# Altium schematic sheet CPU_Memory.SchDoc
size A3
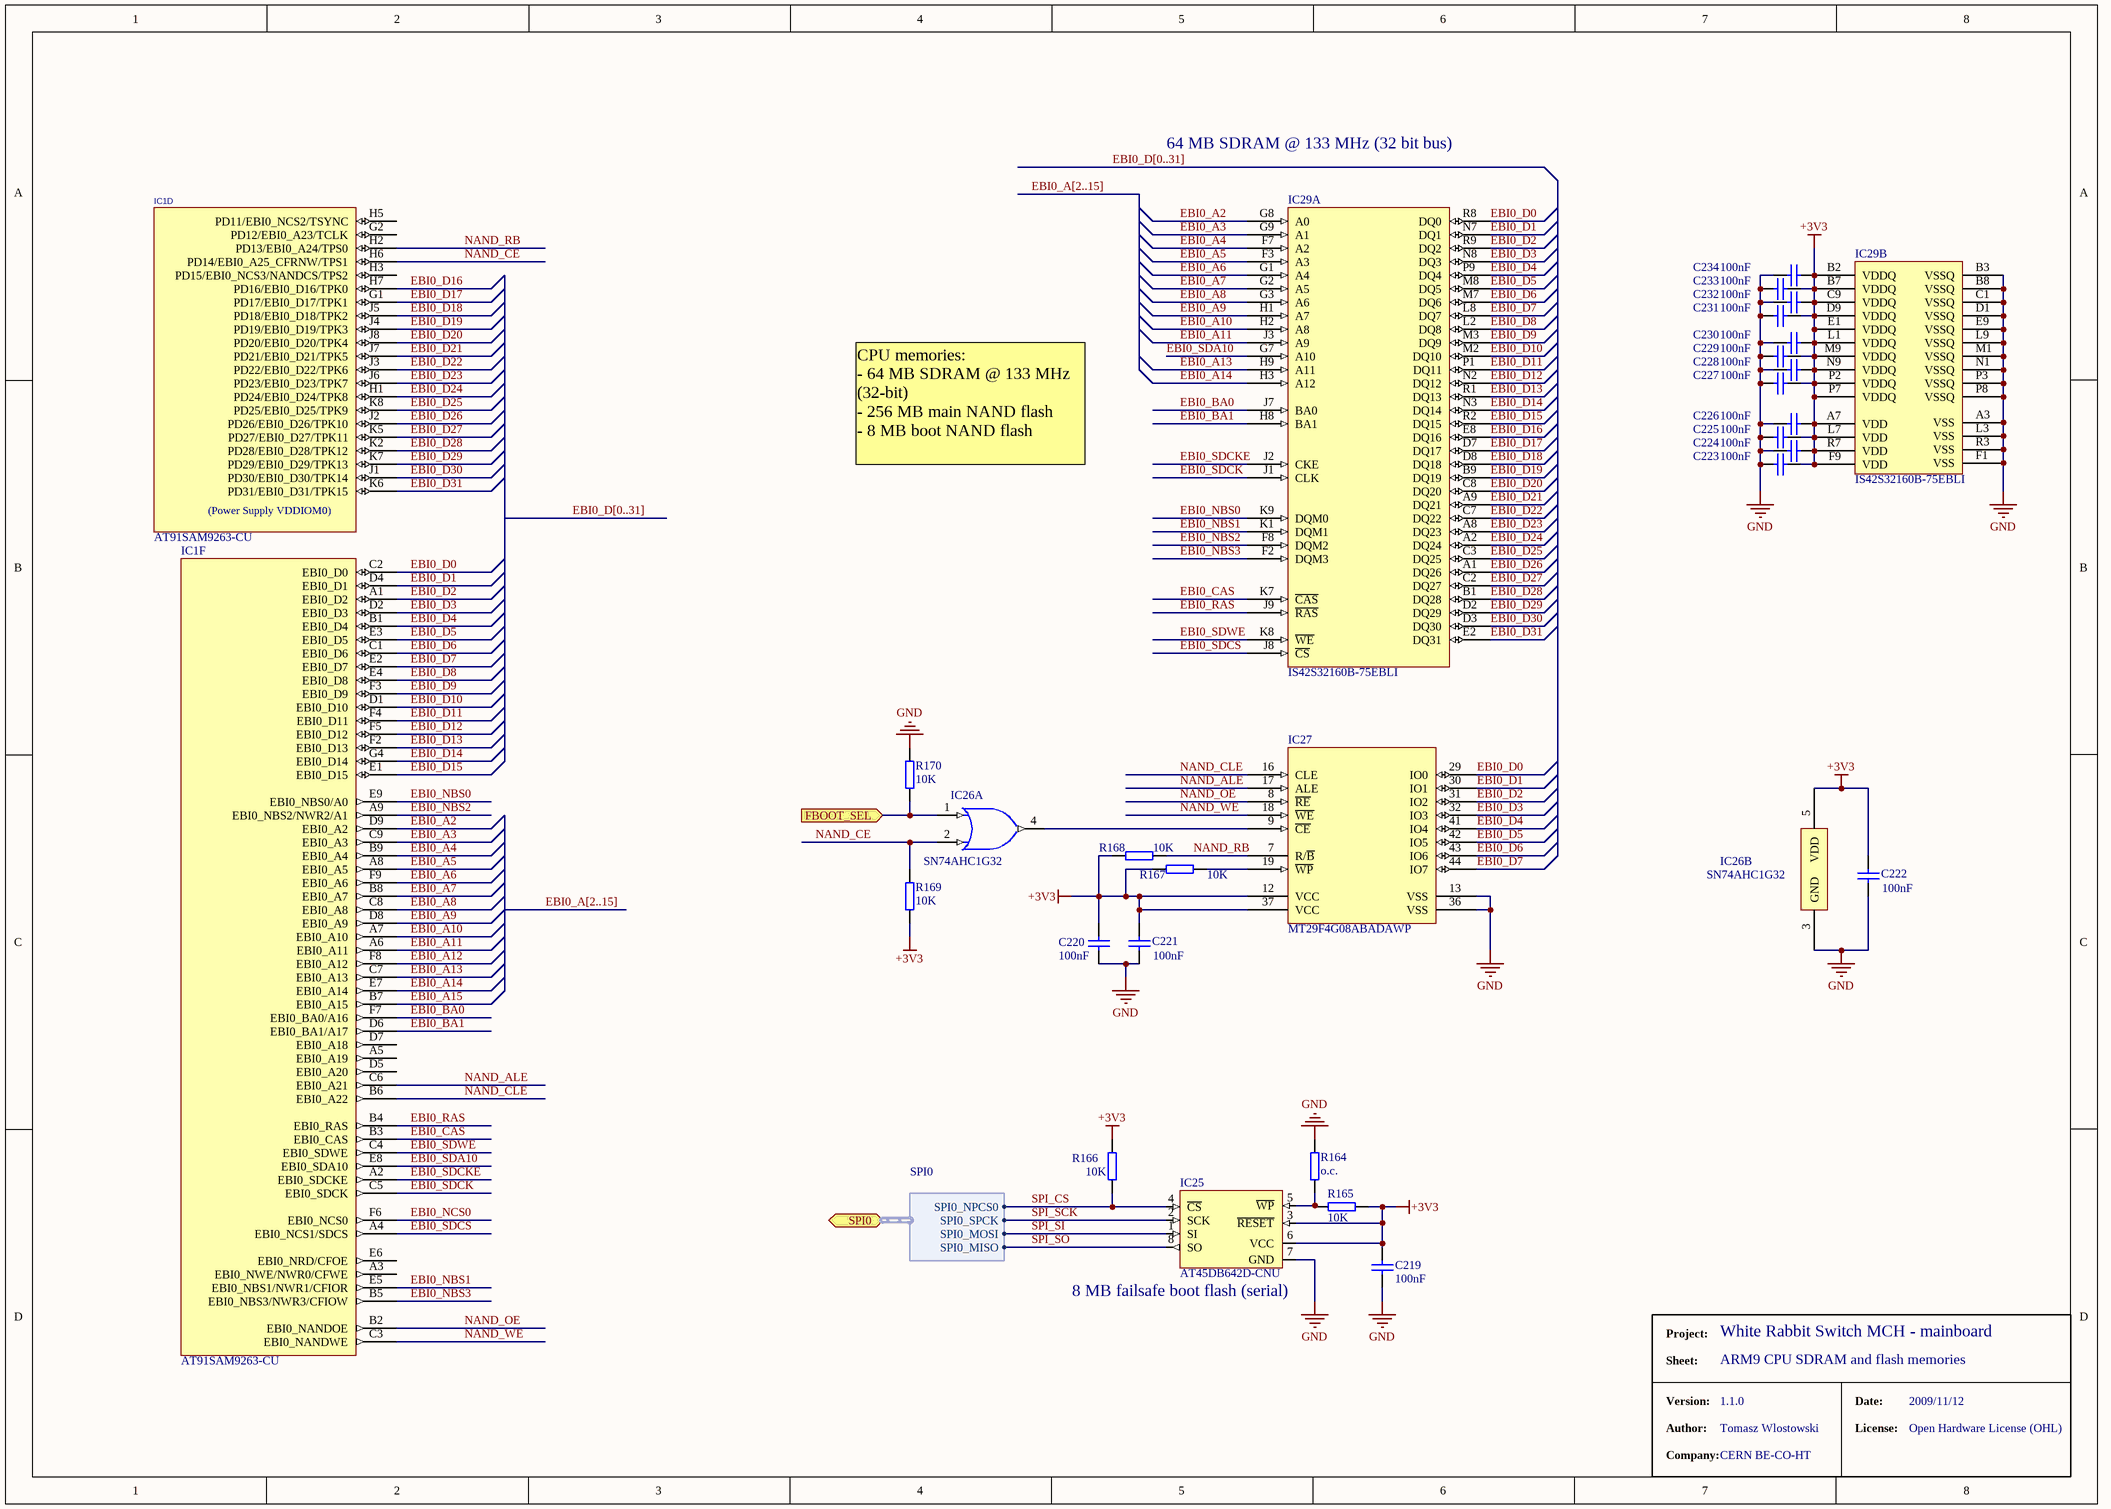
[diagram p0: CPU_Memory.SchDoc]

## Parts
(Parts that share a designator on the sheet are numbered #1, #2 ... from top to bottom, then left to right.)
C219  100nF  [CC1005-0402]
C220  100nF  [CC1005-0402]
C221  100nF  [CC1005-0402]
C222  100nF  [CC1005-0402]
C223  100nF  [CC1005-0402]
C224  100nF  [CC1005-0402]
C225  100nF  [CC1005-0402]
C226  100nF  [CC1005-0402]
C227  100nF  [CC1005-0402]
C228  100nF  [CC1005-0402]
C229  100nF  [CC1005-0402]
C230  100nF  [CC1005-0402]
C231  100nF  [CC1005-0402]
C232  100nF  [CC1005-0402]
C233  100nF  [CC1005-0402]
C234  100nF  [CC1005-0402]
IC1#1  AT91SAM9263-CU  [TFBGA324]  (part D of 12)
IC1#2  AT91SAM9263-CU  [TFBGA324]  (part F of 9)
IC25  AT45DB642D-CNU  [8CN3]
IC26  SN74AHC1G32  [SOT23-5AL]  (parts A,B of 2)
IC27  MT29F4G08ABADAWP  [TSOP48_12x20]
IC29  IS42S32160B-75EBLI  [BGA90C80P9X15_1300X1100X120]  (parts A,B of 2)
R164  o.c.  [0402]
R165  10K  [0402]
R166  10K  [0402]
R167  10K  [0402]
R168  10K  [0402]
R169  10K  [0402]
R170  10K  [0402]

## Ports
FBOOT_SEL (in), SPI0 (harness SPI0)

## Harnesses
SPI0: SPI0_MISO, SPI0_MOSI, SPI0_SPCK, SPI0_NPCS0

## Nets
+3V3: C219.1 C220.2 C221.2 C222.2 C223.1 C224.1 C225.1 C226.1 C227.1 C228.1 C229.1 C230.1 C231.1 C232.1 C233.1 C234.1 IC25.3(~{RESET}) IC25.6(VCC) IC26.5(VDD) IC27.12(VCC) IC27.37(VCC) IC29.A7(VDD) IC29.B2(VDDQ) IC29.B7(VDDQ) IC29.C9(VDDQ) IC29.D9(VDDQ) IC29.E1(VDDQ) IC29.F9(VDD) IC29.L1(VDDQ) IC29.L7(VDD) IC29.M9(VDDQ) IC29.N9(VDDQ) IC29.P2(VDDQ) IC29.P7(VDDQ) IC29.R7(VDD) R165.2 R166.2 R167.2 R168.2 R169.2
GND: C219.2 C220.1 C221.1 C222.1 C223.2 C224.2 C225.2 C226.2 C227.2 C228.2 C229.2 C230.2 C231.2 C232.2 C233.2 C234.2 IC25.7(GND) IC26.3(GND) IC27.13(VSS) IC27.36(VSS) IC29.A3(VSS) IC29.B3(VSSQ) IC29.B8(VSSQ) IC29.C1(VSSQ) IC29.D1(VSSQ) IC29.E9(VSSQ) IC29.F1(VSS) IC29.L3(VSS) IC29.L9(VSSQ) IC29.M1(VSSQ) IC29.N1(VSSQ) IC29.P3(VSSQ) IC29.P8(VSSQ) IC29.R3(VSS) R164.1 R170.2
EBI0_A2: IC1#2.D9(EBI0_A2) IC29.G8(A0)
EBI0_A3: IC1#2.C9(EBI0_A3) IC29.G9(A1)
EBI0_A4: IC1#2.B9(EBI0_A4) IC29.F7(A2)
EBI0_A5: IC1#2.A8(EBI0_A5) IC29.F3(A3)
EBI0_A6: IC1#2.F9(EBI0_A6) IC29.G1(A4)
EBI0_A7: IC1#2.B8(EBI0_A7) IC29.G2(A5)
EBI0_A8: IC1#2.C8(EBI0_A8) IC29.G3(A6)
EBI0_A9: IC1#2.D8(EBI0_A9) IC29.H1(A7)
EBI0_A10: IC1#2.A7(EBI0_A10) IC29.H2(A8)
EBI0_A11: IC1#2.A6(EBI0_A11) IC29.J3(A9)
EBI0_A12: IC1#2.F8(EBI0_A12)
EBI0_A13: IC1#2.C7(EBI0_A13) IC29.H9(A11)
EBI0_A14: IC1#2.E7(EBI0_A14) IC29.H3(A12)
EBI0_A15: IC1#2.B7(EBI0_A15)
EBI0_BA0: IC1#2.F7(EBI0_BA0/A16) IC29.J7(BA0)
EBI0_BA1: IC1#2.D6(EBI0_BA1/A17) IC29.H8(BA1)
EBI0_CAS: IC1#2.B3(EBI0_CAS) IC29.K7(~{CAS})
EBI0_D0: IC1#2.C2(EBI0_D0) IC27.29(IO0) IC29.R8(DQ0)
EBI0_D1: IC1#2.D4(EBI0_D1) IC27.30(IO1) IC29.N7(DQ1)
EBI0_D2: IC1#2.A1(EBI0_D2) IC27.31(IO2) IC29.R9(DQ2)
EBI0_D3: IC1#2.D2(EBI0_D3) IC27.32(IO3) IC29.N8(DQ3)
EBI0_D4: IC1#2.B1(EBI0_D4) IC27.41(IO4) IC29.P9(DQ4)
EBI0_D5: IC1#2.E3(EBI0_D5) IC27.42(IO5) IC29.M8(DQ5)
EBI0_D6: IC1#2.C1(EBI0_D6) IC27.43(IO6) IC29.M7(DQ6)
EBI0_D7: IC1#2.E2(EBI0_D7) IC27.44(IO7) IC29.L8(DQ7)
EBI0_D8: IC1#2.E4(EBI0_D8) IC29.L2(DQ8)
EBI0_D9: IC1#2.F3(EBI0_D9) IC29.M3(DQ9)
EBI0_D10: IC1#2.D1(EBI0_D10) IC29.M2(DQ10)
EBI0_D11: IC1#2.F4(EBI0_D11) IC29.P1(DQ11)
EBI0_D12: IC1#2.F5(EBI0_D12) IC29.N2(DQ12)
EBI0_D13: IC1#2.F2(EBI0_D13) IC29.R1(DQ13)
EBI0_D14: IC1#2.G4(EBI0_D14) IC29.N3(DQ14)
EBI0_D15: IC1#2.E1(EBI0_D15) IC29.R2(DQ15)
EBI0_D16: IC1#1.H7(PD16/EBI0_D16/TPK0) IC29.E8(DQ16)
EBI0_D17: IC1#1.G1(PD17/EBI0_D17/TPK1) IC29.D7(DQ17)
EBI0_D18: IC1#1.J5(PD18/EBI0_D18/TPK2) IC29.D8(DQ18)
EBI0_D19: IC1#1.J4(PD19/EBI0_D19/TPK3) IC29.B9(DQ19)
EBI0_D20: IC1#1.J8(PD20/EBI0_D20/TPK4) IC29.C8(DQ20)
EBI0_D21: IC1#1.J7(PD21/EBI0_D21/TPK5) IC29.A9(DQ21)
EBI0_D22: IC1#1.J3(PD22/EBI0_D22/TPK6) IC29.C7(DQ22)
EBI0_D23: IC1#1.J6(PD23/EBI0_D23/TPK7) IC29.A8(DQ23)
EBI0_D24: IC1#1.H1(PD24/EBI0_D24/TPK8) IC29.A2(DQ24)
EBI0_D25: IC1#1.K8(PD25/EBI0_D25/TPK9) IC29.C3(DQ25)
EBI0_D26: IC1#1.J2(PD26/EBI0_D26/TPK10) IC29.A1(DQ26)
EBI0_D27: IC1#1.K5(PD27/EBI0_D27/TPK11) IC29.C2(DQ27)
EBI0_D28: IC1#1.K2(PD28/EBI0_D28/TPK12) IC29.B1(DQ28)
EBI0_D29: IC1#1.K7(PD29/EBI0_D29/TPK13) IC29.D2(DQ29)
EBI0_D30: IC1#1.J1(PD30/EBI0_D30/TPK14) IC29.D3(DQ30)
EBI0_D31: IC1#1.K6(PD31/EBI0_D31/TPK15) IC29.E2(DQ31)
EBI0_NBS0: IC1#2.E9(EBI0_NBS0/A0) IC29.K9(DQM0)
EBI0_NBS1: IC1#2.E5(EBI0_NBS1/NWR1/CFIOR) IC29.K1(DQM1)
EBI0_NBS2: IC1#2.A9(EBI0_NBS2/NWR2/A1) IC29.F8(DQM2)
EBI0_NBS3: IC1#2.B5(EBI0_NBS3/NWR3/CFIOW) IC29.F2(DQM3)
EBI0_NCS0: IC1#2.F6(EBI0_NCS0)
EBI0_RAS: IC1#2.B4(EBI0_RAS) IC29.J9(~{RAS})
EBI0_SDA10: IC1#2.E8(EBI0_SDA10) IC29.G7(A10)
EBI0_SDCK: IC1#2.C5(EBI0_SDCK) IC29.J1(CLK)
EBI0_SDCKE: IC1#2.A2(EBI0_SDCKE) IC29.J2(CKE)
EBI0_SDCS: IC1#2.A4(EBI0_NCS1/SDCS) IC29.J8(~{CS})
EBI0_SDWE: IC1#2.C4(EBI0_SDWE) IC29.K8(~{WE})
FBOOT_SEL: IC26.1(A) R170.1 ; port FBOOT_SEL
NAND_ALE: IC1#2.C6(EBI0_A21) IC27.17(ALE)
NAND_CE: IC1#1.H6(PD14/EBI0_A25_CFRNW/TPS1) IC26.2(B) R169.1
NAND_CLE: IC1#2.B6(EBI0_A22) IC27.16(CLE)
NAND_OE: IC1#2.B2(EBI0_NANDOE) IC27.8(~{RE})
NAND_RB: IC1#1.H2(PD13/EBI0_A24/TPS0) IC27.7(R/~{B}) R168.1
NAND_WE: IC1#2.C3(EBI0_NANDWE) IC27.18(~{WE})
SPI_CS: IC25.4(~{CS}) R166.1 ; port SPI0.SPI0_NPCS0
SPI_SCK: IC25.2(SCK) ; port SPI0.SPI0_SPCK
SPI_SI: IC25.1(SI) ; port SPI0.SPI0_MOSI
SPI_SO: IC25.8(SO) ; port SPI0.SPI0_MISO
NetIC25_5: IC25.5(~{WP}) R164.2 R165.1
NetIC26_4: IC26.4(Y) IC27.9(~{CE})
NetIC27_19: IC27.19(~{WP}) R167.1

Not connected (* = marked no-connect by the designer): IC1#1 G2(PD12/EBI0_A23/TCLK) H3(PD15/EBI0_NCS3/NANDCS/TPS2) H5(PD11/EBI0_NCS2/TSYNC); IC1#2 A3(EBI0_NWE/NWR0/CFWE) A5(EBI0_A19) D5(EBI0_A20) D7(EBI0_A18) E6(EBI0_NRD/CFOE)

## Buses and harness runs
bus EBI0_A[2..15]
bus EBI0_D[0..31]

## Notes on the sheet
- 64 MB SDRAM @ 133 MHz (32 bit bus)
- CPU memories:
  - 64 MB SDRAM @ 133 MHz (32-bit)
  - 256 MB main NAND flash
  - 8 MB boot NAND flash
- 8 MB failsafe boot flash (serial)
- Project:
- Sheet:
- ARM9 CPU SDRAM and flash memories
- White Rabbit Switch MCH - mainboard
- Version:
- Author:
- Company:
- 1.1.0
- Tomasz Wlostowski
- CERN BE-CO-HT
- Date:
- License:
- 2009/11/12
- Open Hardware License (OHL)
- (in symbol AT91SAM9263, part D) (Power Supply VDDIOM0)

## Library data of the parts
C219-C234 = CC0402_100NF_16V_10%_X7R: Capacitor; Manufacturer1: TDK; Manufacturer1 PN: C1005X7R1C104K; TC: X7R; Tolerance: ±10%; Voltage: 16V; Published: 8-Jun-2000; LatestRevisionDate: 17-Jul-2002; LatestRevisionNote: Re-released for DXP Platform.; PackageReference: RAD-0.3; Publisher: Altium Limited; Distributor1: Digikey; Distributor1 PN: 445-4952-1-ND; Case: 0402; Value: 100nF
IC1#1 IC1#2 = AT91SAM9263: Atmel ARM926 MCU; Supplier: EBV; RefId: AT91SAM9263-CU; Value: AT91SAM9263-CU
IC25 = AT45DB642D: 64-megabit 2.7V, Dual-Interface DataFlash; Value: AT45DB642D-CNU; Distributor1 PN: AT45DB642D-CNU-ND; Case: CASON; Distributor1: Digikey
IC26 = SN74AHC1G32: TI single OR gate; RefId: 296-1093-1-ND; Value: SN74AHC1G32DBVR; Supplier: Digikey
IC27 = MT29F4G08ABADAWP: NAND Flash 512Mx8, 3.3V Asynch/Page; Value: MT29F4G08ABADAWP; Distributor1 PN: 557-1458-1-ND; Distributor1: Digikey
IC29 = IS42S32160B-BGA: SDRAM 512MBit (16Mx32) 133MHz BGA-90
R164 = R0402_O.C.: SMD Resistor; Case: 0402; Manufacturer1: N/A; Manufacturer1 PN: N/A; Distributor1: N/A; Distributor1 PN: N/A; TCR: N/A; Power Rating: N/A; Tolerance: N/A; Value: o.c.
R165-R170 = R0402_10K_±1%_0.1W_100PPM: SMD Resistor; Manufacturer1: Panasonic; Manufacturer1 PN: ERJ-2RKF1002X; TCR: 100ppm; Power Rating: 0.1W; Tolerance: ±1%; Case: 0402; Distributor1: DigiKey; Distributor1 PN: P10.0KLCT-ND; Value: 10K